# Altium schematic sheet Interfaces.SchDoc
size A4; SheetNumber: 6; SheetTotal: 6
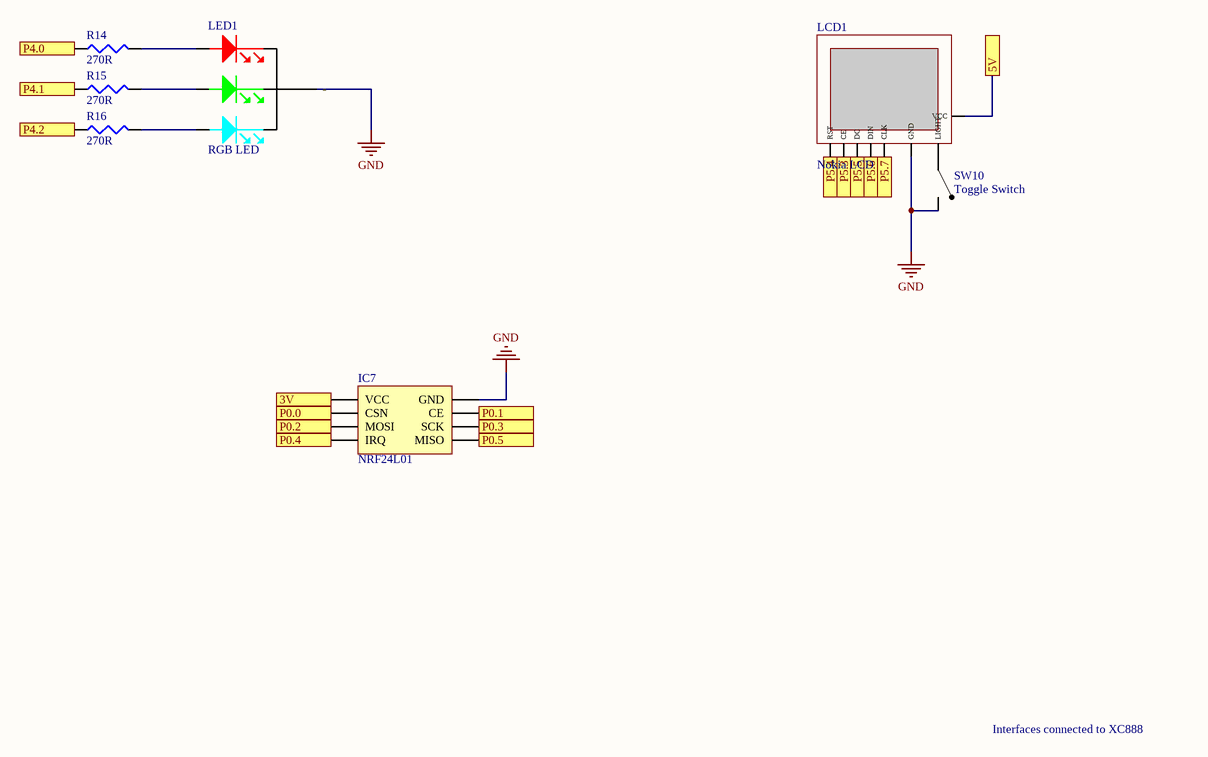
[diagram p0: Interfaces.SchDoc]

## Parts
IC7  NRF24L01  [NRF header]
LCD1  Nokia LCD  [LCD header]
LED1  RGB LED  [4 PIN - RGB LED]
R14  270R  [CRG0402F]
R15  270R  [CRG0402F]
R16  270R  [CRG0402F]
SW10  Toggle Switch  [SMD Switch]

## Ports
3V, 5V, P0.0, P0.1, P0.2, P0.3, P0.4, P0.5, P4.0, P4.1, P4.2, P5.3, P5.4, P5.5, P5.6, P5.7

## Nets
GND: IC7.2(GND) LCD1.8(GND) LED1.2(-) SW10.2
3V: IC7.1(VCC) ; port 3V
5V: LCD1.6(VCC) ; port 5V
P0.0: IC7.3(CSN) ; port P0.0
P0.1: IC7.4(CE) ; port P0.1
P0.2: IC7.5(MOSI) ; port P0.2
P0.3: IC7.6(SCK) ; port P0.3
P0.4: IC7.7(IRQ) ; port P0.4
P0.5: IC7.8(MISO) ; port P0.5
P4.0: R14.1 ; port P4.0
P4.1: R15.1 ; port P4.1
P4.2: R16.1 ; port P4.2
P5.3: LCD1.2(CE) ; port P5.3
P5.4: LCD1.1(RST) ; port P5.4
P5.5: LCD1.3(DC) ; port P5.5
P5.6: LCD1.4(DIN) ; port P5.6
P5.7: LCD1.5(CLK) ; port P5.7
NetLCD1_7: LCD1.7(LIGHT) SW10.1
NetLED1_1: LED1.1 R16.2
NetLED1_3: LED1.3 R15.2
NetLED1_4: LED1.4 R14.2

## Notes on the sheet
- Interfaces connected to XC888

## Library data of the parts
IC7 = NRF24L01 Module
LCD1 = Nokia 5110 LCD: Category: LCD Display
LED1 = WP154A4SUREQBFZGC: Hyper Red/Green/Blue 50º Water Clear Full Color LED Lamp - T-1 3/4; Manufacturer: Kingbright; Color: Blue,Green,Red; Forward Voltage: 4V; Viewing Angle: 60°; Luminous Intensity: 500mcd; Lens Style: Dome; Test Current: 20mA; Dominant Wavelength: 465nm; Power Rating: 120mW; Reverse Voltage (DC): 5V; Supplier 1: Digi-Key; Manufacturer Part Number: WP154A4SUREQBFZGC; RoHS: Yes; Category: LEDs; Stock 1: 39551; Pricing 1: 1=1,98000, 10=1,25100, 100=0,92560, 500=0,85054, 1000=0,70800 (USD); Mount: Through Hole; Case/Package: Radial; Weight: 0.01411oz; Min Operating Temperature: -40°C; Max Operating Temperature: 85°C; Packaging: Bulk; Package Quantity: 500; Forward Current: 20mA; Lens Transparency: Clear; Operating Supply Voltage: 4V; Height: 8.6mm; RoHS Compliant: Yes; Lead Free: Lead Free; ComponentLink1URL: https://datasheet.ciiva.com/6349/wp154a4sureqbfzgc-6349426.pdf?src-supplier=Digi-Key; ComponentLink1Description: https://datasheet.ciiva.com/6349/wp154a4sureqbfzgc-6349426.pdf?src-supplier=Digi-Key; ComponentLink2URL: https://datasheet.ciiva.com/13501/wp154a4sureqbfzgc-194997-13501708.pdf?src-supplier=Mouser; ComponentLink2Description: https://datasheet.ciiva.com/13501/wp154a4sureqbfzgc-194997-13501708.pdf?src-supplier=Mouser; Supplier Part Number 1: 754-1615-ND
R14-R16 = CRG0402F270R: Res Thick Film 0402 270 Ohm 1% 0.063W(1/16W) ±100ppm/C Pad SMD T/R; Manufacturer: TE Connectivity; Temperature Coefficient: 100ppm/°C; Max Power Dissipation: 63mW; Voltage Rating: 50V; Number of Resistors: 1; Supplier 1: Newark; Manufacturer Part Number: CRG0402F270R; RoHS: Yes; Category: Chip SMD Resistors; Stock 1: 50238; Pricing 1: 1=0,00500, 10=0,00400, 25=0,00400, 50=0,00400, 100=0,00400 (USD); Mount: Surface Mount; Case/Package: 0402; Case Code (Imperial): 0402; Case Code (Metric): 1005; Weight: 2.3E-05oz; Min Operating Temperature: -55°C; Max Operating Temperature: 125°C; Packaging: Tape and Reel; Resistance: 270R; Tolerance: 1%; Resistor Type: Thick Film; Package Quantity: 10000; Number of Terminations: 2; Series: CRG, Neohm; Power Rating: 63mW; Termination: Solder; Voltage Rating (DC): 50V; Technology: THICK FILM; Resistance Tolerance: 1%; Length: 1mm; Width: 0.5mm; Height: 0.35mm; Depth: 0.5mm; RoHS Compliant: Yes; REACH SVHC: No SVHC; ELV: Compliant; ComponentLink1URL: https://datasheet.ciiva.com/11811/0900766b80d0914d-11811952.pdf?src-supplier=RSComponents; ComponentLink1Description: https://datasheet.ciiva.com/11811/0900766b80d0914d-11811952.pdf?src-supplier=RSComponents; ComponentLink2URL: https://datasheet.ciiva.com/12563/eng-ds-1773204-g-12563015.pdf?src-supplier=Mouser; ComponentLink2Description: https://datasheet.ciiva.com/12563/eng-ds-1773204-g-12563015.pdf?src-supplier=Mouser; ComponentLink3URL: https://datasheet.ciiva.com/22706/1610603-22706089.pdf?src-supplier=Element14; ComponentLink3Description: https://datasheet.ciiva.com/22706/1610603-22706089.pdf?src-supplier=Element14; ComponentLink4URL: https://datasheet.ciiva.com/17122/70063020-17122922.pdf?src-supplier=Allied+Electronics; ComponentLink4Description: https://datasheet.ciiva.com/17122/70063020-17122922.pdf?src-supplier=Allied+Electronics; Supplier Part Number 1: 95W7454
SW10 = SK12D07VG3NS: C&K SK-12D07-VG 3 NS Switches > Slide > Miniature > Mini R/A Slide; Manufacturer: ITT C&K; Supplier 1: Digi-Key; Manufacturer Part Number: SK12D07VG3NS; RoHS: No; Category: Uncategorized; Pricing 1: 30000=0,24375 (USD); Package Quantity: 1000; ComponentLink1URL: http://www.mouser.com/ds/2/60/sk-965380.pdf?src-supplier=Mouser; ComponentLink1Description: http://www.mouser.com/ds/2/60/sk-965380.pdf?src-supplier=Mouser; ComponentLink2URL: https://www.ckswitches.com/media/1432/sk.pdf?src-supplier=Digi-Key; ComponentLink2Description: https://www.ckswitches.com/media/1432/sk.pdf?src-supplier=Digi-Key; Supplier Part Number 1: SK12D07VG3NS-ND